# EAGLE design Seeeduino LoRaWan (EAGLE 9.3.2)
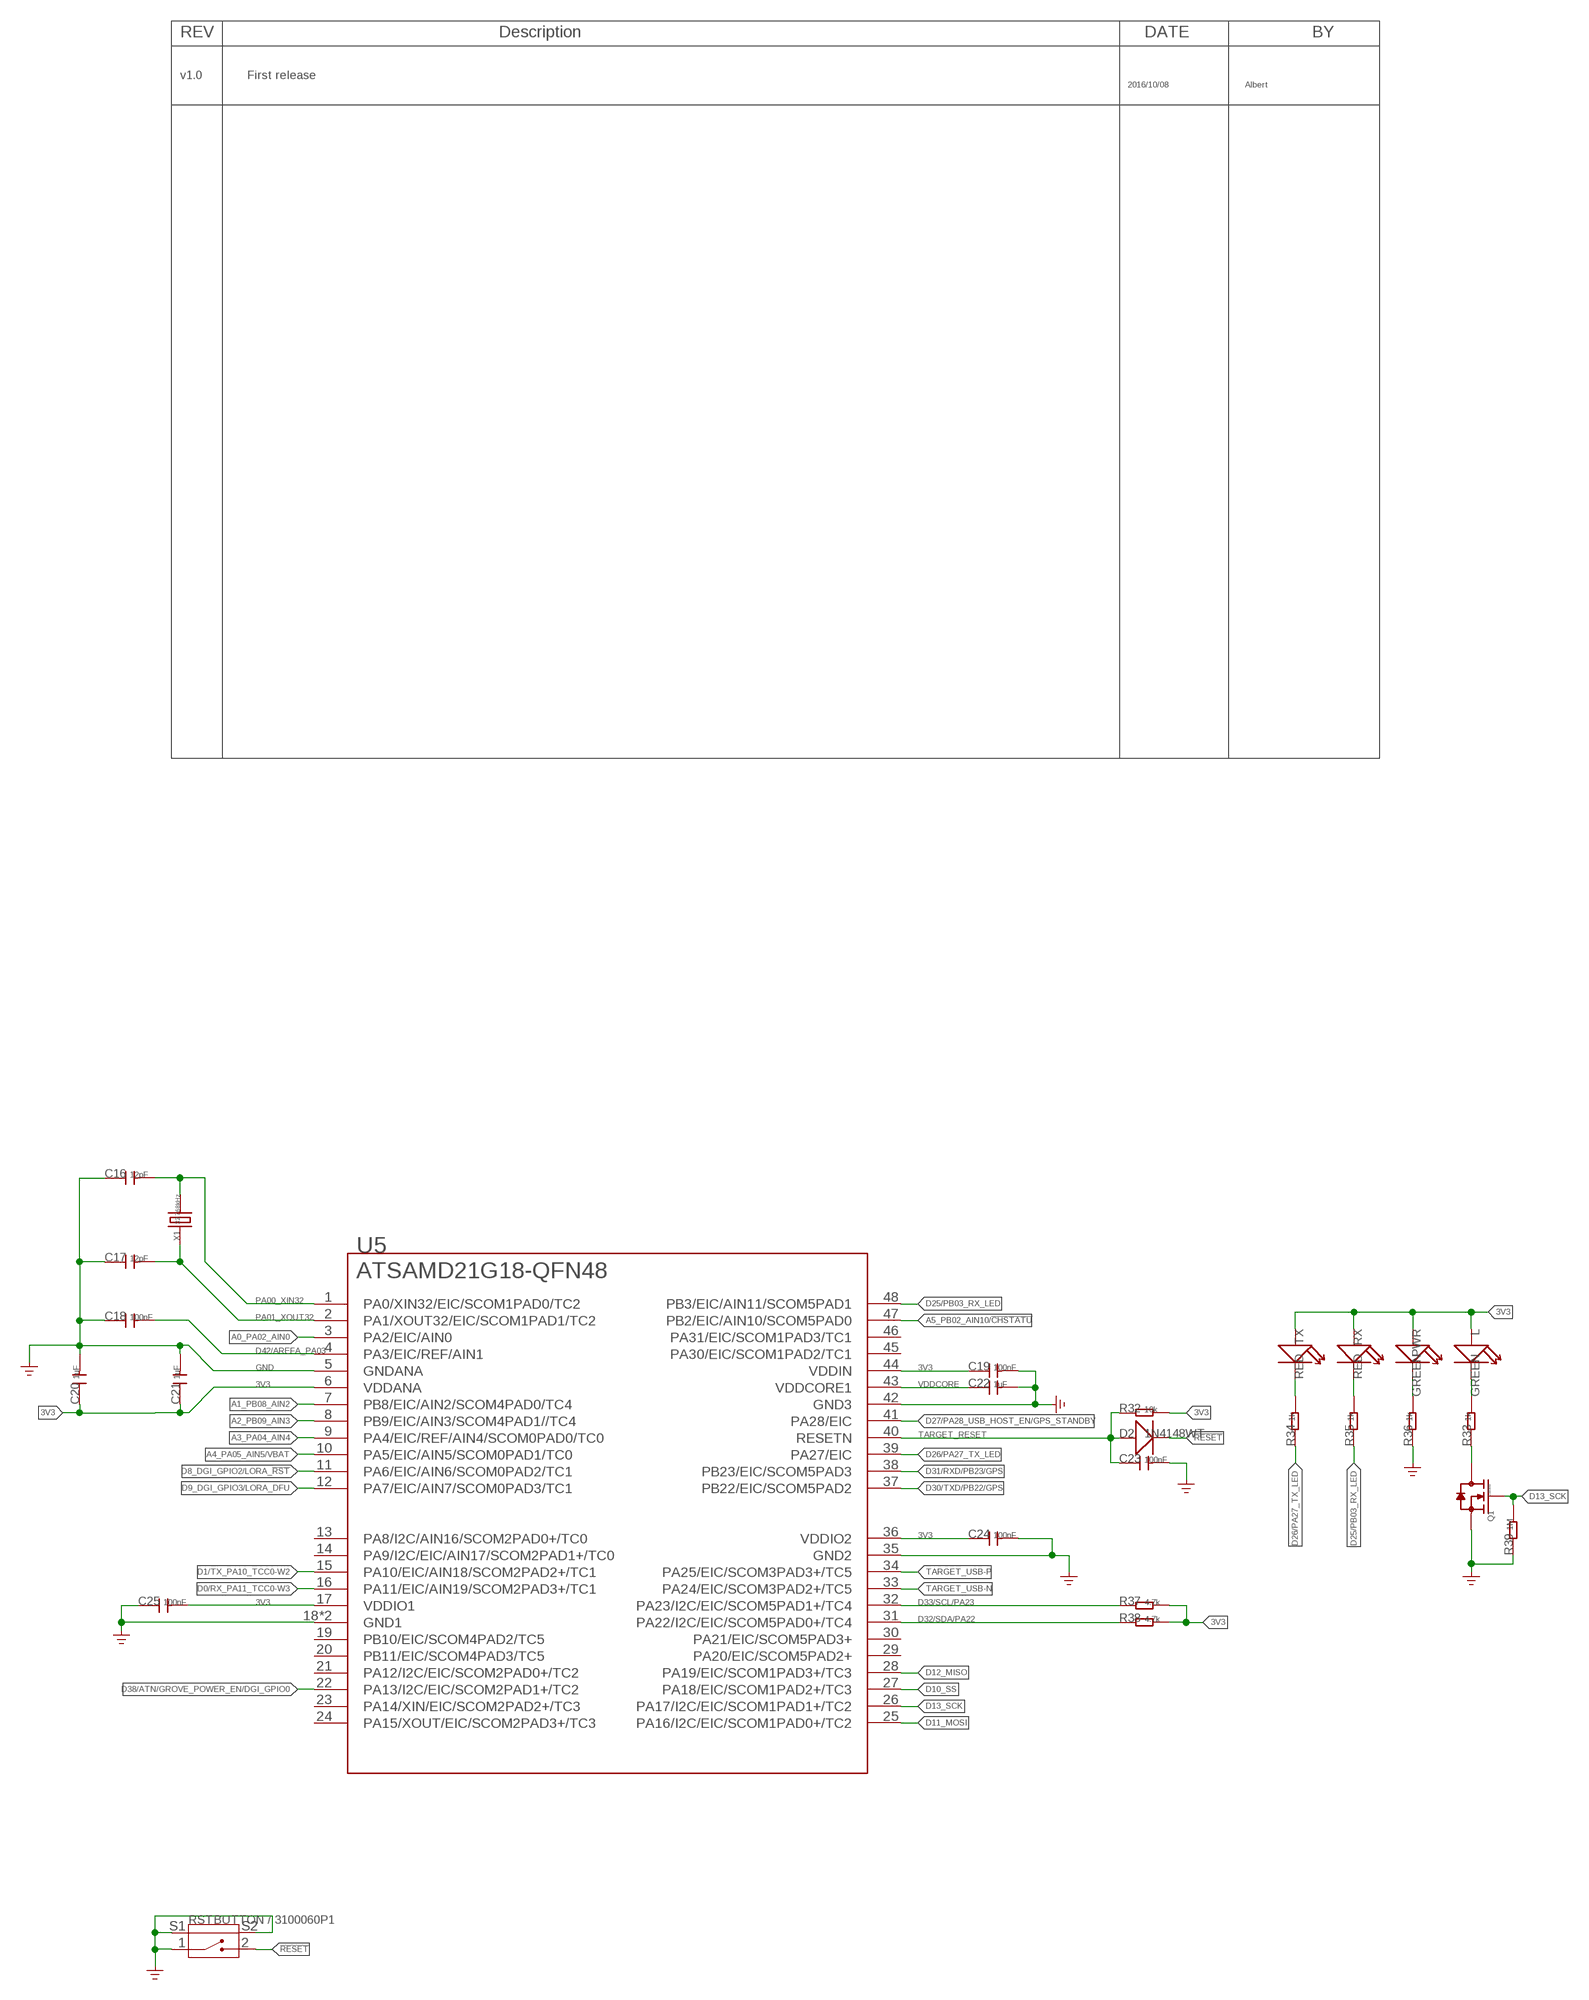
[diagram p0: schematic, sheet 1, part 1 of 2]
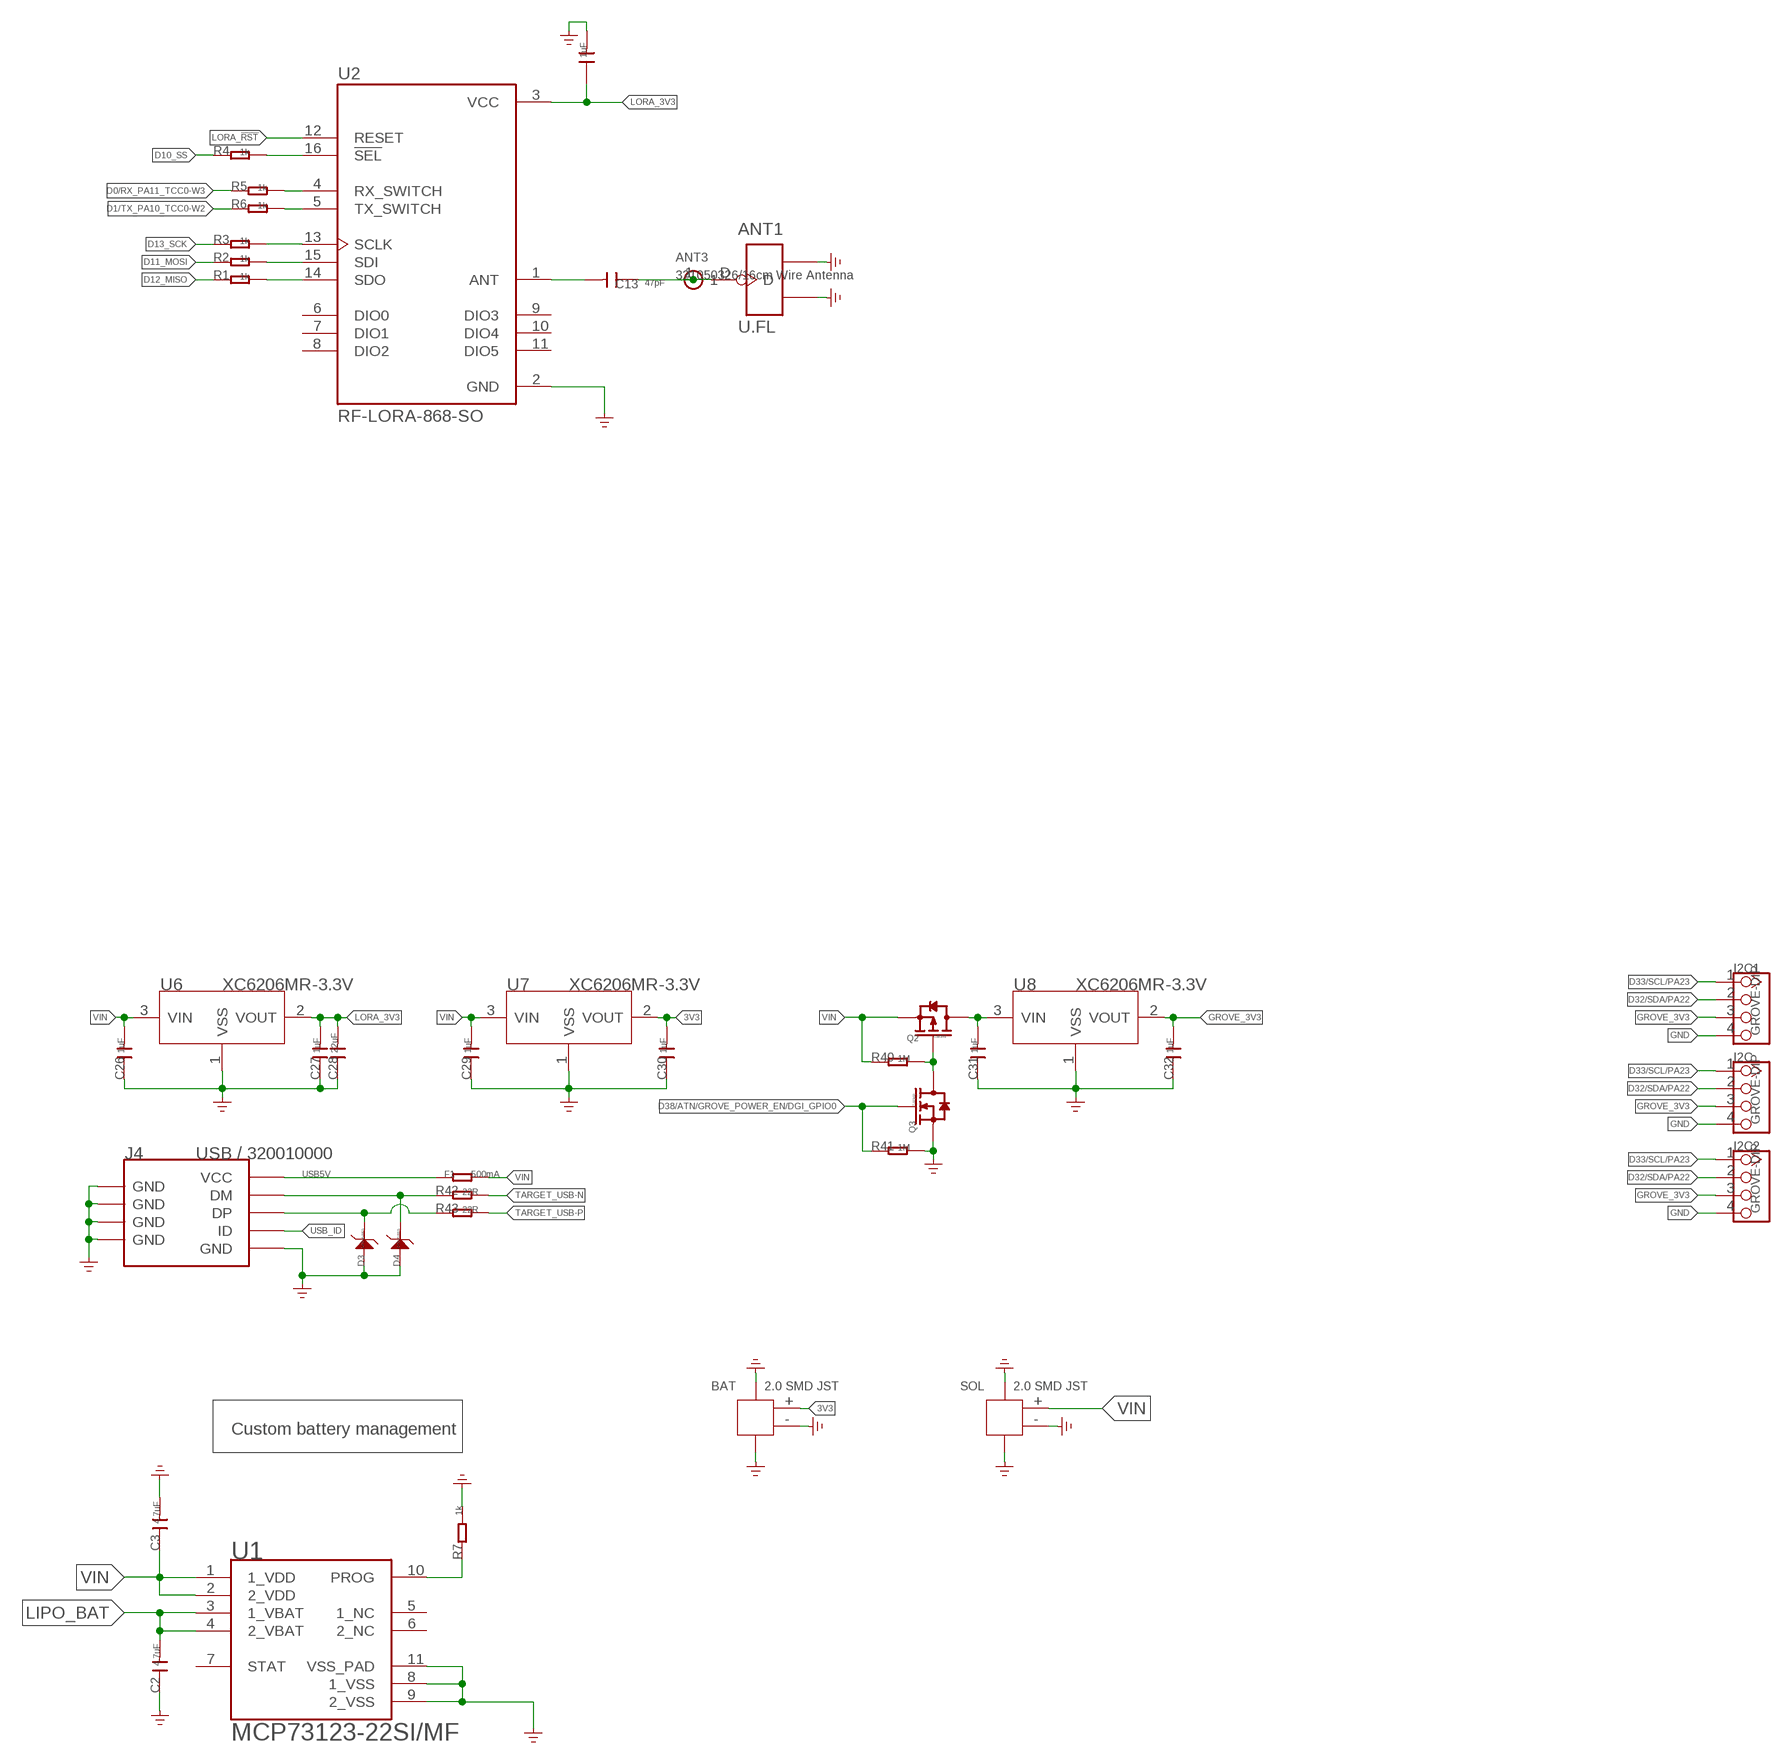
[diagram p1: schematic, sheet 1, part 2 of 2]

## Parts
ANT1  U.FL  ANTENNA-U-FL  [U-FL3P-SMD-2.6X2.6X1.0MM]
ANT3  321050326/16cm Wire Antenna  HEADER-1P-35  [1P-65/35MIL]
BAT  2.0 SMD JST  JST-2P-SMD'2.0'  [HW2-SMD-2.0-90D]
C1  1uF  C-0603  [C0603]
C2  4.7uF  C-0603  [C0603]
C3  4.7uF  C-0603  [C0603]
C13  47pF  C-0603  [C0603]
C16  12pF  C-0603  [C0603]
C17  12pF  C-0603  [C0603]
C18  100nF  C-0603  [C0603]
C19  100nF  C-0603  [C0603]
C20  1uF  C-0603  [C0603]
C21  1uF  C-0603  [C0603]
C22  1uF  C-0603  [C0603]
C23  100nF  C-0603  [C0603]
C24  100nF  C-0603  [C0603]
C25  100nF  C-0603  [C0603]
C26  1uF  C-0603  [C0603]
C27  1uF  C-0603  [C0603]
C28  22uF  C-0603  [C0603]
C29  1uF  C-0603  [C0603]
C30  1uF  C-0603  [C0603]
C31  1uF  C-0603  [C0603]
C32  1uF  C-0603  [C0603]
D2  1N4148WT  D'0603'  [SOD523]
D3  DF2S6.8FS  D-ESD-2P'DF2S6.8FS'  [SOD-923]
D4  DF2S6.8FS  D-ESD-2P'DF2S6.8FS'  [SOD-923]
F1  500mA  R-0603  [R0603]
I2C  GROVE-DIP  TWIG-4P-2.0-2.0  [4P-2.0]
I2C1  GROVE-DIP  TWIG-4P-2.0-2.0  [4P-2.0]
I2C2  GROVE-DIP  TWIG-4P-2.0-2.0  [4P-2.0]
J4  USB / 320010000  USB-MINIUSB-5P-MICRO  [MICRO-USB]
L  GREEN  LED'0603'  [LED-0603]
PWR  GREEN  LED'0603'  [LED-0603]
Q1  CJ2102  MOSFET-N'SI1304BDL'  [SOT-323]
Q2  CJ2101  MOSFET-P-SOT323  [SOT323]
Q3  CJ2102  MOSFET-N'SI1304BDL'  [SOT-323]
R1  1k  R-0603  [R0603]
R2  1k  R-0603  [R0603]
R3  1k  R-0603  [R0603]
R4  1k  R-0603  [R0603]
R5  1k  R-0603  [R0603]
R6  1k  R-0603  [R0603]
R7  1k  R-0603  [R0603]
R32  10k  R-0603  [R0603]
R33  1k  R-0603  [R0603]
R34  1k  R-0603  [R0603]
R35  1k  R-0603  [R0603]
R36  1k  R-0603  [R0603]
R37  4.7k  R-0603  [R0603]
R38  4.7k  R-0603  [R0603]
R39  1M  R-0603  [R0603]
R40  1M  R-0603  [R0603]
R41  1M  R-0603  [R0603]
R42  22R  R-0603  [R0603]
R43  22R  R-0603  [R0603]
RST  BUTTON / 3100060P1  BUTTON-2P-REINFORCE-3100060P1  [4P-SMD-7.0X3.5X3.5H-90D]
RX  RED  LED'0603'  [LED-0603]
SOL  2.0 SMD JST  JST-2P-SMD'2.0'  [HW2-SMD-2.0-90D]
TX  RED  LED'0603'  [LED-0603]
U1  MICROCHIP_MCP73123-22SI-MFMICROCHIP_MCP73123-22SI-MF_0_0  [MICROCHIP_MCP73123-22SI-MF_0]
U2  RF-LORA-868-SO  [XCVR_RF-LORA-868-SO]
U5  ATSAMD21G18-QFN48  [QFN48-7X7]
U6  XC6206MR-3.3V  XC6206MR  [SOT23]
U7  XC6206MR-3.3V  XC6206MR  [SOT23]
U8  XC6206MR-3.3V  XC6206MR  [SOT23]
X1  32.768kHz  CRYSTAL-2P-3215  [X2-SMD-3.2X1.5X0.55MM]

## Nets
3V3: BAT.+ C19.1 C20.1 C21.1 C24.1 C25.2 C30.2 L.+ PWR.+ R32.2 R37.2 R38.2 RX.+ TX.+ U5.6(VDDANA) U5.17(VDDIO1) U5.36(VDDIO2) U5.44(VDDIN) U7.2(VOUT)
!RESET: D2.- RST.2
A0_PA02_AIN0: U5.3(PA2/EIC/AIN0)
A1_PB08_AIN2: U5.7(PB8/EIC/AIN2/SCOM4PAD0/TC4)
A2_PB09_AIN3: U5.8(PB9/EIC/AIN3/SCOM4PAD1//TC4)
A3_PA04_AIN4: U5.9(PA4/EIC/REF/AIN4/SCOM0PAD0/TC0)
A4_PA05_AIN5/VBAT: U5.10(PA5/EIC/AIN5/SCOM0PAD1/TC0)
A5_PB02_AIN10/!CHSTATU: U5.47(PB2/EIC/AIN10/SCOM5PAD0)
D0/RX_PA11_TCC0-W3: R5.1 U5.16(PA11/EIC/AIN19/SCOM2PAD3+/TC1)
D1/TX_PA10_TCC0-W2: R6.1 U5.15(PA10/EIC/AIN18/SCOM2PAD2+/TC1)
D8_DGI_GPIO2/LORA_!RST: U5.11(PA6/EIC/AIN6/SCOM0PAD2/TC1)
D9_DGI_GPIO3/LORA_DFU: U5.12(PA7/EIC/AIN7/SCOM0PAD3/TC1)
D10_SS: R4.1 U5.27(PA18/EIC/SCOM1PAD2+/TC3)
D11_MOSI: R2.1 U5.25(PA16/I2C/EIC/SCOM1PAD0+/TC2)
D12_MISO: R1.1 U5.28(PA19/EIC/SCOM1PAD3+/TC3)
D13_SCK: Q1.1(G) R3.1 R39.2 U5.26(PA17/I2C/EIC/SCOM1PAD1+/TC2)
D25/PB03_RX_LED: R35.1 U5.48(PB3/EIC/AIN11/SCOM5PAD1)
D26/PA27_TX_LED: R34.1 U5.39(PA27/EIC)
D27/PA28_USB_HOST_EN/GPS_STANDBY: U5.41(PA28/EIC)
D30/TXD/PB22/GPS: U5.37(PB22/EIC/SCOM5PAD2)
D31/RXD/PB23/GPS: U5.38(PB23/EIC/SCOM5PAD3)
D32/SDA/PA22: I2C1.2 I2C2.2 I2C.2 R38.1 U5.31(PA22/I2C/EIC/SCOM5PAD0+/TC4)
D33/SCL/PA23: I2C1.1 I2C2.1 I2C.1 R37.1 U5.32(PA23/I2C/EIC/SCOM5PAD1+/TC4)
D38/ATN/GROVE_POWER_EN/DGI_GPIO0: Q3.1(G) R41.1 U5.22(PA13/I2C/EIC/SCOM2PAD1+/TC2)
D42/AREFA_PA03: C18.2 U5.4(PA3/EIC/REF/AIN1)
GND: ANT1.GND1 ANT1.GND2 BAT.3 BAT.4 BAT.- C1.2 C2.1 C3.2 C16.1 C17.1 C18.1 C19.2 C20.2 C21.2 C22.2 C23.2 C24.2 C25.1 C26.1 C27.1 C28.1 C29.1 C30.1 C31.1 C32.1 D3.2 D4.2 I2C1.4 I2C2.4 I2C.4 J4.5(GND) J4.S1(GND) J4.S2(GND) J4.S3(GND) J4.S4(GND) J4.S5(GND) J4.S6(GND) Q1.2(S) Q3.2(S) R7.2 R36.1 R39.1 R41.2 RST.1 RST.S1 RST.S2 SOL.3 SOL.4 SOL.- U1.8(1_VSS) U1.9(2_VSS) U1.11(VSS_PAD) U2.2(GND) U5.5(GNDANA) U5.18(GND1) U5.35(GND2) U5.42(GND3) U5.PAD(GND1) U6.1(VSS) U7.1(VSS) U8.1(VSS) ; supply symbol labelled GND_POWER
GROVE_3V3: C32.2 I2C1.3 I2C2.3 I2C.3 U8.2(VOUT)
LIPO_BAT: C2.2 U1.3(1_VBAT) U1.4(2_VBAT)
LORA_3V3: C1.1 C27.2 C28.2 U2.3(VCC) U6.2(VOUT)
N$1: Q1.3(D) R33.1
N$2: R34.2 TX.-
N$3: C13.2 U2.1(ANT)
N$4: R35.2 RX.-
N$5: L.- R33.2
N$6: R1.2 U2.14(SDO)
N$7: D3.1 J4.3(DP) R43.1
N$10: D4.1 J4.2(DM) R42.1
N$11: ANT1.D ANT3.1 C13.1
N$12: PWR.- R36.2
N$13: R2.2 U2.15(SDI)
N$14: R3.2 U2.13(SCLK)
N$15: R4.2 U2.16(!SEL)
N$16: R5.2 U2.4(RX_SWITCH)
N$17: R6.2 U2.5(TX_SWITCH)
N$18: R7.1 U1.10(PROG)
N$20: U2.12(RESET)
N$45: C31.2 Q2.3(D) U8.3(VIN)
N$53: Q2.1(G) Q3.3(D) R40.2
PA00_XIN32: C16.2 U5.1(PA0/XIN32/EIC/SCOM1PAD0/TC2) X1.2
PA01_XOUT32: C17.2 U5.2(PA1/XOUT32/EIC/SCOM1PAD1/TC2) X1.1
TARGET_RESET: C23.1 D2.+ R32.1 U5.40(RESETN)
TARGET_USB-N: R42.2 U5.33(PA24/EIC/SCOM3PAD2+/TC5)
TARGET_USB-P: R43.2 U5.34(PA25/EIC/SCOM3PAD3+/TC5)
USB5V: F1.1 J4.1(VCC)
USB_ID: J4.4(ID)
VDDCORE: C22.1 U5.43(VDDCORE1)
VIN: C3.1 C26.2 C29.2 F1.2 Q2.2(S) R40.1 SOL.+ U1.1(1_VDD) U1.2(2_VDD) U6.3(VIN) U7.3(VIN)
Unconnected: U1.5(1_NC) U1.6(2_NC) U1.7(STAT) U2.6(DIO0) U2.7(DIO1) U2.8(DIO2) U2.9(DIO3) U2.10(DIO4) U2.11(DIO5) U5.13(PA8/I2C/AIN16/SCOM2PAD0+/TC0) U5.14(PA9/I2C/EIC/AIN17/SCOM2PAD1+/TC0) U5.19(PB10/EIC/SCOM4PAD2/TC5) U5.20(PB11/EIC/SCOM4PAD3/TC5) U5.21(PA12/I2C/EIC/SCOM2PAD0+/TC2) U5.23(PA14/XIN/EIC/SCOM2PAD2+/TC3) U5.24(PA15/XOUT/EIC/SCOM2PAD3+/TC3) U5.29(PA20/EIC/SCOM5PAD2+) U5.30(PA21/EIC/SCOM5PAD3+) U5.45(PA30/EIC/SCOM1PAD2/TC1) U5.46(PA31/EIC/SCOM1PAD3/TC1)

## Notes on the sheet
- v1.0 | First release
- 2016/10/08 | Albert
- Custom battery management

## Library data of the parts
ANT1 = Connector-update:ANTENNA-U-FL: 320110048
ANT3 = Connector:HEADER-1P
BAT SOL = Connector-update:JST-2P-SMD: 2P-SMD-1.0-90D:320110054;2P-SMD-2.0-90D:320110026
C1-C3 C13 C16-C32 = Discrete:C*: Ceramic Capacitors
D2 = Discrete:D*
D3 D4 = Discrete-new:D-ESD-2P: SOD-923:304060009;SOD-123:304060001
F1 = Discrete-smallsmall:R*
I2C I2C1 I2C2 = Connector:TWIG-4P-2.0
J4 = Connector:USB-MINIUSB-5P
L PWR RX TX = Discrete:LED*
Q1 Q3 = Discrete-new:MOSFET-N
Q2 = Discrete:MOSFET-P
R1-R7 R32-R43 = Discrete:R*
RST = Discrete:BUTTON-2P-REINFORCE: TS-1188E http://www.best-dz.com/?thread-374-2.html SMD Button
U1 = PMIC:MICROCHIP_MCP73123-22SI-MF: Lithium Iron Phosphate (LiFePO4) Battery Charge Management Controller with Input Overvoltage Protection; CENTROID_NOT_SPECIFIED: No; DATASHEET: https://upverter.com/datasheet/166ccaed19ce623439533fa8540cd622d7261b1c.pdf; DIGIKEY_DESCRIPTION: IC LI IRON PHOSPHATE CTRLR 10DFN; DIGIKEY_PART_NUMBER: MCP73123-22SI/MF-ND; LEAD_FREE: yes; MF: Microchip; MOUSER_PART_NUMBER: 579-MCP73123-22SI/MF; MPN: MCP73123-22SI/MF; PACKAGE: 10-DFN; PREFIX: U; ROHS: yes; TEMPERATURE_RANGE_HIGH: +85°C; TEMPERATURE_RANGE_LOW: -40°C
U2 = LoRa:RF-LORA-868-SO: LORA RF Tranceiver Module 16km 1272 SO; DESCRIPTION: LORA RF Tranceiver Module 16km 1272 SO; DIGI-KEY_PART_NUMBER: RF-LORA-868-SO-ND; DIGI-KEY_PURCHASE_URL: https://www.digikey.com/product-detail/en/rf-solutions/RF-LORA-868-SO/RF-LORA-868-SO-ND/5291460?utm_source=snapeda&utm_medium=aggregator&utm_campaign=symbol; MF: RF Solutions; MP: RF-LORA-868-SO; PACKAGE: Module RF Solutions
U5 = AMLib_New:ATSAMD21G18: Atmel D21 32bit ARM Cortex-M0 microcontroller - 48 PIN TQFP 256KB flash memory + 32KB SRAM
U6-U8 = IC:XC6206: LOW ESR Cap.Compatible Positive Voltage Regulators
X1 = Discrete-new:CRYSTAL-2P

## Net classes
0 default: width 0.025 mm, drill 0.203 mm, clearance 0.127 mm

## Board
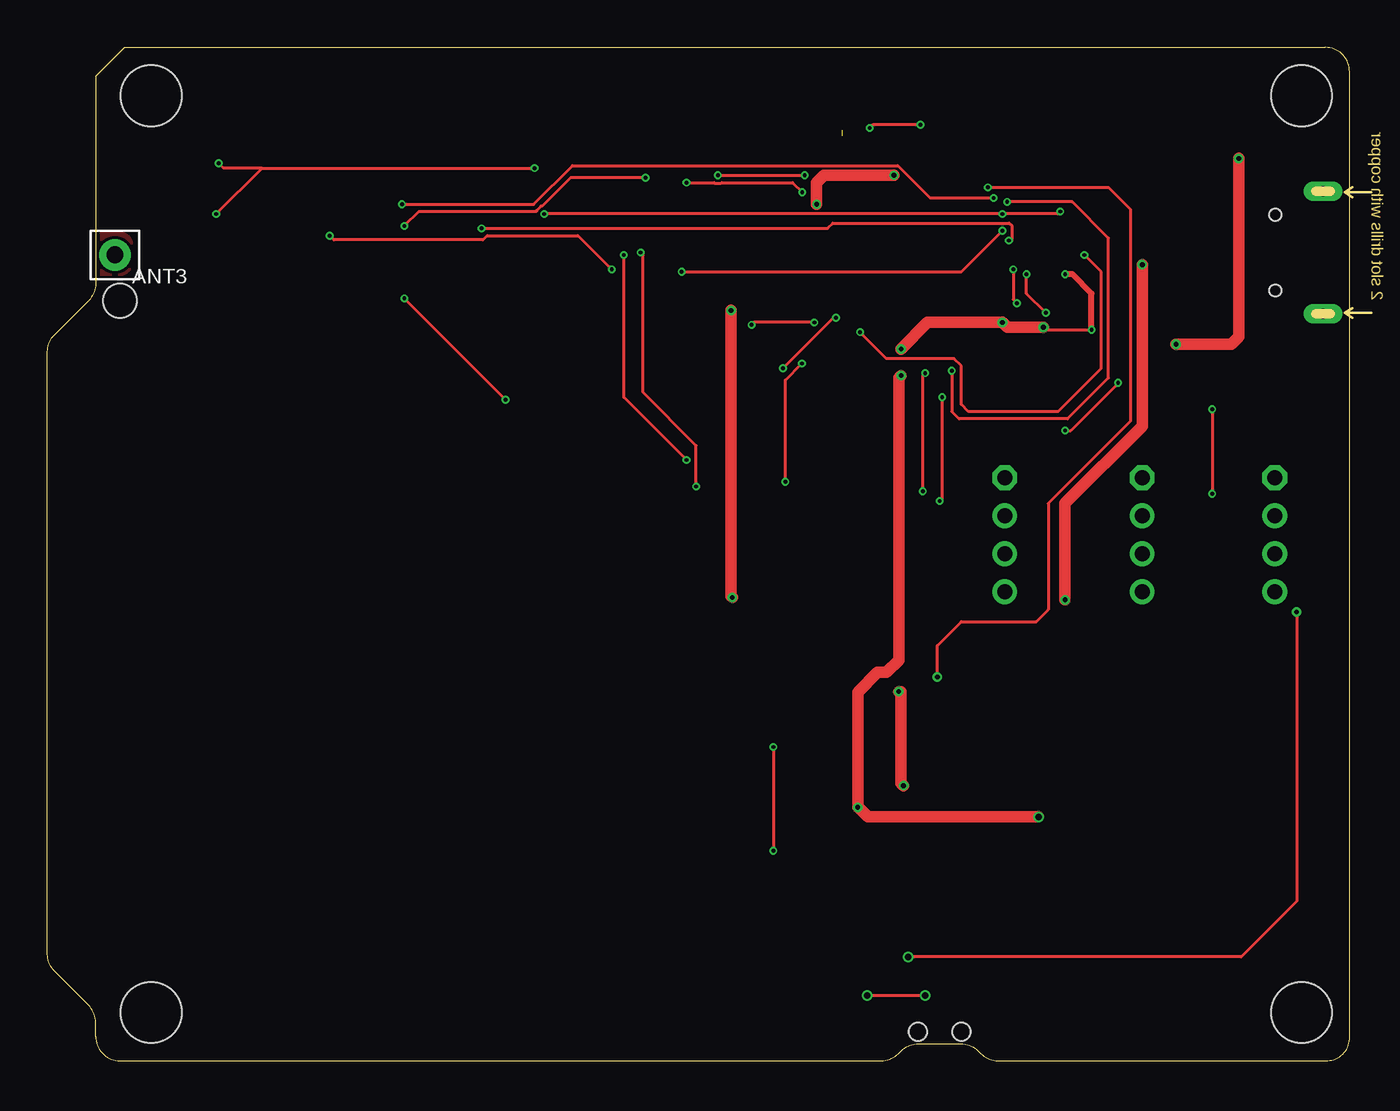
[diagram p2: board, top side]
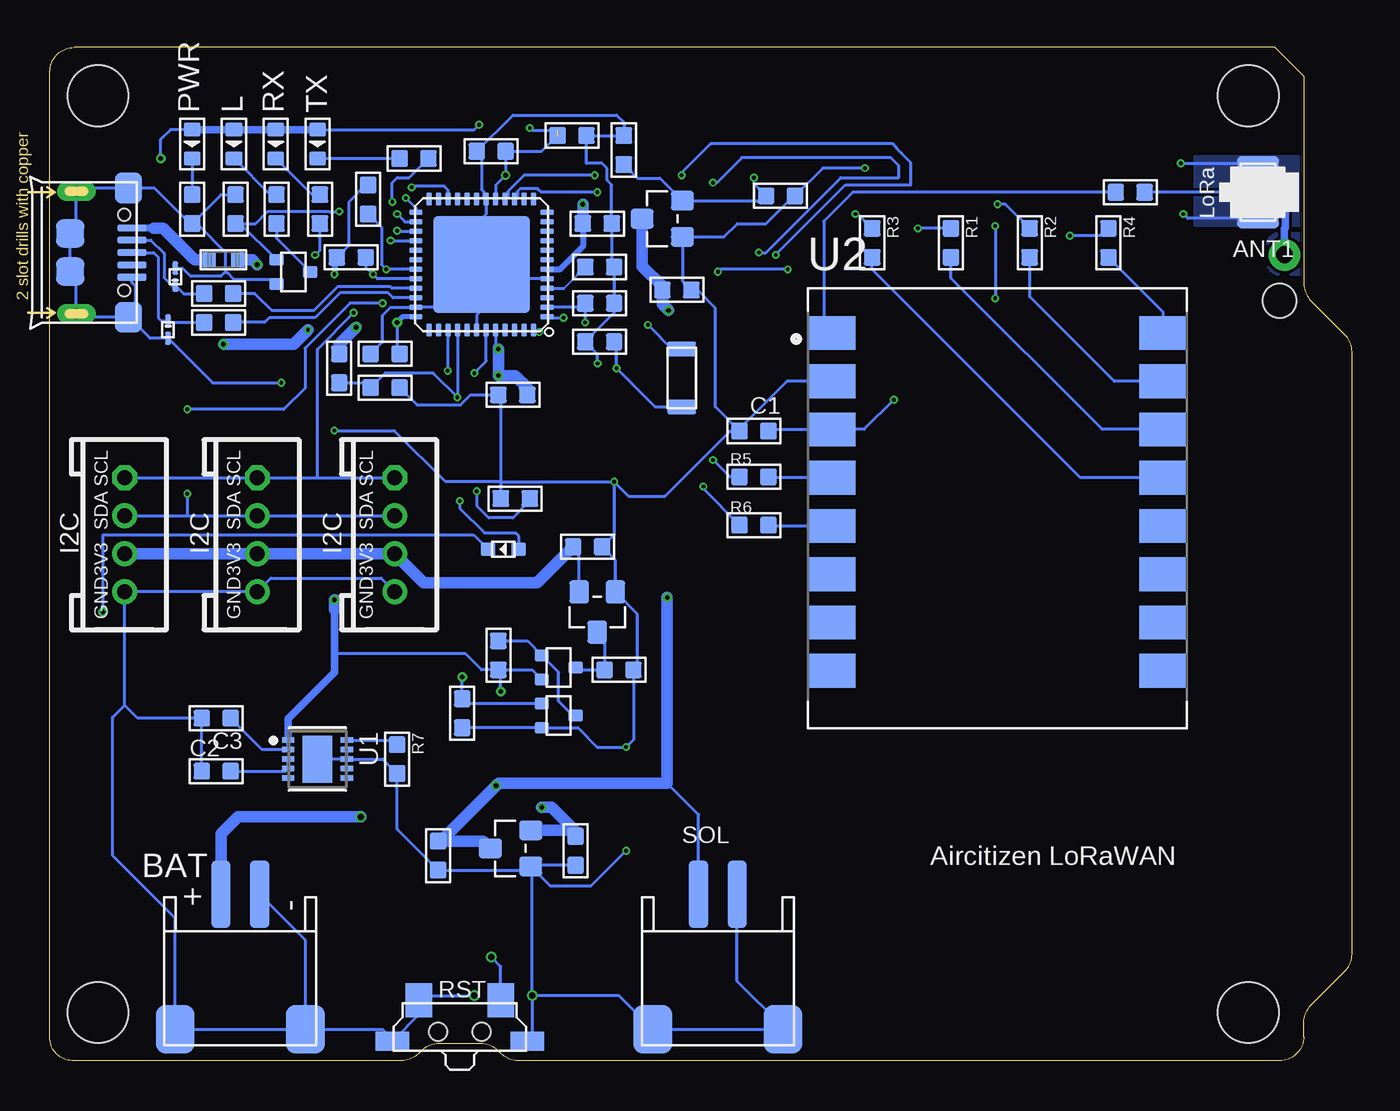
[diagram p3: board, bottom side, seen from below]

Size 68.58 x 53.34 mm. Coordinates in mm from the lower left corner, seen from the top.
Outline: 68.58,52.07 arc90 67.31,53.34 4.06,53.34 2.54,51.82 2.54,40.91 arc-45 2.17,40.01 0.37,38.22 arc45 0,37.32 0,5.61 arc45 0.37,4.71 2.17,2.91 arc-45 2.54,2.01 2.54,1.27 arc90 3.81,0 43.92,0 arc45 44.82,0.37 44.97,0.52 arc-45 45.87,0.89 48.12,0.89 arc-45 49.01,0.52 49.16,0.37 arc45 50.06,0 67.31,0 arc90 68.58,1.14 68.58,52.07
Copper layers (1*16): Top 0.035mm / dielectric 1.5mm / Bottom 0.035mm
Design rules "default *": minimum track width 1mil, minimum drill 8mil, track to track 5mil, track to pad 5mil, pad to pad 5mil, via to via 5mil, smd to smd 0mil, copper to edge 8mil, drill to drill 8mil, minimum pad ring 4mil, minimum via ring 4mil, stop-mask expansion 4mil, vias tented up to drill 20mil, thermal gap 10mil
Holes 3.2 mm at 66.04,2.54 66.04,50.8 5.46,2.54 5.46,50.8
Holes 1.78 mm at 3.81,40.01
bRestrict: area 42.9,39 to 48.8,44.8; area 51.1,19.3 to 53.1,21.3

### Footprints (pad centres in the part's own frame; a part is rotated, then mirrored left to right if it is on the bottom)
U-FL3P-SMD-2.6X2.6X1.0MM = smd 1.05 x 1: D -1.397,0 | smd 2.2 x 1.05: GND1 0,1.373; GND2 0,-1.373
1P-65/35MIL = drill 0.889 pad 1.651: 1 0,0
HW2-SMD-2.0-90D = smd 2.032 x 2.54: 3 3.429,-2.159; 4 -3.429,-2.159 | smd 1.016 x 3.556: + -1.016,4.953; - 1.016,4.953
C0603 = smd 0.889 x 0.889: 1 -0.762,0; 2 0.762,0
SOD523 = smd 0.762 x 0.7: + -0.8,0; - 0.8,0
SOD-923 = smd 0.7 x 0.3: 1 -0.45,0; 2 0.45,0
R0603 = smd 0.7 x 0.8: 1 -0.75,0; 2 0.75,0
4P-2.0 = drill 0.8 pad 1.3 octagon: 1 -3,0 | drill 0.8 pad 1.3: 2 -1,0; 3 1,0; 4 3,0
MICRO-USB = smd 0.381 x 1.524: 1 -1.3,-0.25; 2 -0.65,-0.25; 3 0,-0.25; 4 0.65,-0.25; 5 1.3,-0.25 | smd 1.6 x 1.397: S1 -3.4,-0.427; S6 3.4,-0.427 | drill 0.508 pad 1.016 long: S2 -3.226,-3.175; S5 3.226,-3.175 | smd 1.5 x 1.5: S3 -1,-3.5; S4 1,-3.5 | hole 0.635: -2,-0.65; 2,-0.65
LED-0603 = smd 0.762 x 0.889: + -0.762,0; - 0.762,0
SOT-323 = smd 0.635 x 0.762: 1 -0.635,-0.889; 2 0.635,-0.889; 3 0,0.889
SOT323 = smd 0.635 x 0.762: 1 -0.635,-0.889; 2 0.635,-0.889; 3 0,0.889
R0603' = smd 0.889 x 0.889: 1 -0.762,0; 2 0.762,0
4P-SMD-7.0X3.5X3.5H-90D = smd 1.397 x 1.778: 1 -2.159,1.651; 2 2.159,1.651 | smd 1.778 x 1.016: S1 -3.556,-0.508; S2 3.556,-0.508 | hole 0.95: -1.15,0; 1.15,0
MICROCHIP_MCP73123-22SI-MF_0 = smd 0.3 x 0.65: 1 -1,-1.55; 2 -0.5,-1.55; 3 0,-1.55; 4 0.5,-1.55; 5 1,-1.55; 6 1,1.55; 7 0.5,1.55; 8 0,1.55; 9 -0.5,1.55; 10 -1,1.55 | smd 2.48 x 1.55: 11 0,0
XCVR_RF-LORA-868-SO = smd 2.5 x 1.78: 1 -8.725,9.225; 2 -8.725,6.685; 3 -8.725,4.145; 4 -8.725,1.605; 5 -8.725,-0.935; 6 -8.725,-3.475; 7 -8.725,-6.015; 8 -8.725,-8.555; 9 8.725,-8.555; 10 8.725,-6.015; 11 8.725,-3.475; 12 8.725,-0.935; 13 8.725,1.605; 14 8.725,4.145; 15 8.725,6.685; 16 8.725,9.225
QFN48-7X7 = smd 0.7 x 0.3: 1 -3.45,2.75; 2 -3.45,2.25; 3 -3.45,1.75; 4 -3.45,1.25; 5 -3.45,0.75; 6 -3.45,0.25; 7 -3.45,-0.25; 8 -3.45,-0.75; 9 -3.45,-1.25; 10 -3.45,-1.75; 11 -3.45,-2.25; 12 -3.45,-2.75; 25 3.45,-2.75; 26 3.45,-2.25; 27 3.45,-1.75; 28 3.45,-1.25; 29 3.45,-0.75; 30 3.45,-0.25; 31 3.45,0.25; 32 3.45,0.75; 33 3.45,1.25; 34 3.45,1.75; 35 3.45,2.25; 36 3.45,2.75 | smd 0.3 x 0.7: 13 -2.75,-3.45; 14 -2.25,-3.45; 15 -1.75,-3.45; 16 -1.25,-3.45; 17 -0.75,-3.45; 18 -0.25,-3.45; 19 0.25,-3.45; 20 0.75,-3.45; 21 1.25,-3.45; 22 1.75,-3.45; 23 2.25,-3.45; 24 2.75,-3.45; 37 2.75,3.45; 38 2.25,3.45; 39 1.75,3.45; 40 1.25,3.45; 41 0.75,3.45; 42 0.25,3.45; 43 -0.25,3.45; 44 -0.75,3.45; 45 -1.25,3.45; 46 -1.75,3.45; 47 -2.25,3.45; 48 -2.75,3.45 | smd 5.1 x 5.1: PAD 0,0
SOT23 = smd 1.016 x 1.2: 1 -0.95,-1.06; 2 0.95,-1.06; 3 0,1.06
X2-SMD-3.2X1.5X0.55MM = smd 0.762 x 1.524: 1 -1.524,0; 2 1.524,0

### Placement (x,y rotation side)
ANT1  4.95,45.72 180 bottom
ANT3  3.56,42.42 0 top
BAT  58.55,3.81 0 bottom
C1  31.5,33.15 180 bottom
C2  59.82,15.24 0 bottom
C3  59.82,18.03 180 bottom
C13  11.68,45.72 180 bottom
C16  39.62,37.85 0 bottom
C17  39.62,39.88 180 bottom
C18  39.62,41.78 180 bottom
C19  44.2,35.05 180 bottom
C20  41.08,48.71 0 bottom
C21  39.75,44.07 0 bottom
C22  44.07,29.59 180 bottom
C23  50.93,35.43 0 bottom
C24  50.93,37.21 180 bottom
C25  45.34,47.88 0 bottom
C26  35.56,40.58 180 bottom
C27  38.35,47.94 270 bottom
C28  30.1,45.53 180 bottom
C29  48.13,10.8 90 bottom
C30  40.89,11.05 90 bottom
C31  38.61,20.57 180 bottom
C32  40.26,27.05 180 bottom
D2  44.7,26.92 180 bottom
D3  62.36,38.48 270 bottom
D4  61.98,41.28 90 bottom
F1  59.44,42.16 0 bottom
I2C  64.64,27.69 270 bottom
I2C1  57.66,27.69 270 bottom
I2C2  50.42,27.69 270 bottom
J4  64.01,42.55 270 bottom
L  58.89,48.26 270 bottom
PWR  61.09,48.26 270 bottom
Q1  55.75,41.53 270 bottom
Q2  41.78,20.7 270 bottom
Q3  41.78,18.16 270 bottom
R1  1k  [R0603']  21.12,43.05 270 bottom
R2  1k  [R0603']  16.98,43.05 270 bottom
R3  1k  [R0603']  25.27,43.05 270 bottom
R4  1k  [R0603']  12.83,43.05 270 bottom
R5  1k  [R0603']  31.5,30.73 0 bottom
R6  1k  [R0603']  31.5,28.19 0 bottom
R7  1k  [R0603']  50.29,15.88 270 bottom
R32  10k  [R0603']  53.34,36.45 90 bottom
R33  1k  [R0603']  56.64,44.83 90 bottom
R34  1k  [R0603']  49.4,47.5 180 bottom
R35  1k  [R0603']  54.36,44.83 90 bottom
R36  1k  [R0603']  61.09,44.83 90 bottom
R37  4.7k  [R0603']  52.7,42.29 180 bottom
R38  4.7k  [R0603']  51.82,45.34 90 bottom
R39  1M  [R0603']  58.8,44.83 270 bottom
R40  1M  [R0603']  44.96,21.34 90 bottom
R41  1M  [R0603']  46.86,18.29 270 bottom
R42  22R  [R0603']  59.69,40.39 0 bottom
R43  22R  [R0603']  59.69,38.86 0 bottom
RST  46.99,1.52 0 bottom
RX  56.68,48.26 270 bottom
SOL  33.4,3.81 0 bottom
TX  54.48,48.26 270 bottom
U1  54.48,15.88 270 bottom
U2  18.67,29.08 0 bottom
U5  45.85,41.91 180 bottom
U6  36.32,44.32 90 bottom
U7  44.32,11.18 90 bottom
U8  39.75,23.62 180 bottom
X1  35.31,35.94 270 bottom

### Tracks (layer width: path | path; a pad name or v marks a point on that pad's centre or on a via)
3V3  (via drill 0.2, 0.2 pad 0.41, 0.25 pad 0.41, 0.25 pad 0.51, 0.35)  (1 unrouted)
  Top 0.152: v52.45,38.61 52.58,38.48 v54.99,38.48 | v45.97,49.28 43.48,49.28 v43.31,49.1
  Top 0.305: v54.99,38.48 54.99,40.39 53.98,41.4 v53.59,41.4
  Top 0.61: v44.96,37.47 46.35,38.86 v50.29,38.86 50.55,38.61 v52.45,38.61 | v44.58,46.61 40.89,46.61 40.51,46.23 v40.51,45.09 | v44.96,36.07 44.83,35.94 44.83,22.1 | 44.83,21.21 44.83,22.1 | 44.83,22.1 44.83,21.08 44.2,20.45 43.72,20.45 42.67,19.4 v42.67,13.34 42.67,13.36 43.2,12.83 v52.2,12.83 | v62.74,47.5 62.74,38.1 62.36,37.72 v59.44,37.72
  Bottom 0.152: U5.17 45.1,46.09 v44.58,46.61 C25.2 42.67,47.88 C20.1 | PWR.+ 62.23,49.02 62.74,48.51 v62.74,47.5 | R37.2 52.83,42.93 52.83,45.21 51.94,46.1 R38.2 | U5.44 45.1,37.6 | v50.29,38.86 50.29,37.34 C24.1 | TX.+ 46.23,49.02 v45.97,49.28 | v43.31,49.1 43.18,48.97 41.85,48.97
  Bottom 0.254: U5.36 49.99,39.16 v50.29,38.86
  Bottom 0.305: 45.1,37.6 v44.96,37.47 | v53.59,41.4 53.59,42.16 R37.2 | U5.6 41.72,41.66 40.51,42.86 C21.1
  Bottom 0.406: TX.+ RX.+ L.+ PWR.+
  Bottom 0.61: v59.44,37.72 55.75,37.72 v54.99,38.48 | v52.45,38.61 53.34,37.72 R32.2 | v44.96,37.47 v44.96,36.07 44.07,36.07 43.43,35.43 C19.1 | v40.51,45.09 C21.1 | BAT.+ 59.56,11.94 58.67,12.83 v52.2,12.83 | v42.67,13.34 42.16,13.34 40.89,12.07 C30.2 41.21,12.13 U7.2
!RESET  (via drill 0.25 pad 0.51, 0.35)
  Top 0.152: v65.79,23.62 65.79,8.38 62.87,5.46 v45.34,5.46
  Bottom 0.152: v65.79,23.62 65.79,27.69 46.27,27.69 D2.- | v45.34,5.46 44.83,4.95 RST.2
A5_PB02_AIN10/!CHSTATU
  Bottom 0.152: U5.47 43.6,38.33
D0/RX_PA11_TCC0-W3  (via drill 0.2)
  Top 0.152: v33.66,31.62 30.35,34.93 v30.35,42.42 | v35.31,46.61 v39.88,46.61
  Bottom 0.152: R5.1 32.77,30.73 v33.66,31.62 | v30.35,42.42 26.67,46.1 23.24,46.1 23.24,47.28 23.5,47.54 arc2 24.19,48.26 33.78,48.26 35.31,46.74 v35.31,46.61 | U5.16 44.45,45.51 44.45,45.77 43.61,46.61 v39.88,46.61
D1/TX_PA10_TCC0-W2  (via drill 0.2)
  Top 0.152: v34.16,30.23 34.16,32.39 31.37,35.18 31.37,42.42 v31.24,42.55 | v39.75,45.72 39.24,46.23 35.5,46.23 35.47,46.2 35.14,46.2 35.11,46.23 v33.66,46.23
  Bottom 0.152: R6.1 34.16,30.1 v34.16,30.23 | v31.24,42.55 30.86,42.55 26.92,46.48 23.88,46.48 23.88,47.12 24.3,47.54 32.13,47.54 33.44,46.23 v33.66,46.23 | U5.15 43.95,45.51 43.95,45.77 43.8,45.91 42.89,45.91 42.7,45.72 v39.75,45.72
D10_SS  (via drill 0.2, 0.2 pad 0.41)
  Top 0.152: v29.72,41.66 27.94,43.43 23.16,43.43 22.93,43.21 15.09,43.21 v14.86,43.43 | v33.4,41.53 48.13,41.53 v50.29,43.69
  Bottom 0.152: R4.1 13.21,43.43 v14.86,43.43 | v29.72,41.66 33.27,41.66 v33.4,41.53 | v50.29,43.69 50.26,43.66 U5.27
D11_MOSI  (via drill 0.2 pad 0.41)
  Top 0.152: v18.67,45.09 25.61,45.09 27.64,47.12 44.79,47.12 46.49,45.42 v49.83,45.42
  Bottom 0.152: R2.1 18.25,45.09 v18.67,45.09 | v49.83,45.42 49.3,44.88 U5.25
D12_MISO  (via drill 0.2 pad 0.41)
  Top 0.152: v22.86,43.82 41.08,43.82 41.36,44.09 50.65,44.09 50.8,43.94 50.8,43.18 v50.64,43.18
  Bottom 0.152: R1.1 v22.86,43.82 | v50.64,43.18 49.31,43.18 U5.28
D13_SCK  (via drill 0.2, 0.2 pad 0.41)
  Top 0.152: v26.16,44.58 v50.29,44.58 53.21,44.58 v53.34,44.7
  Bottom 0.152: Q1.1 58.55,44.07 R39.2 57.75,44.07 57.11,44.72 53.89,44.72 53.88,44.7 v53.34,44.7 | R3.1 26.16,44.7 v26.16,44.58 | v50.29,44.58 49.88,44.16 U5.26
D25/PB03_RX_LED  (via drill 0.2 pad 0.41)
  Top 0.152: v42.8,38.35 44.2,36.96 47.75,36.96 48.13,36.58 48.13,34.54 48.51,34.16 53.21,34.16 55.5,36.45 55.5,41.53 v54.61,42.42
  Bottom 0.152: U5.48 42.91,38.46 v42.8,38.35 | v54.61,42.42 54.36,42.67 R35.1
D26/PA27_TX_LED  (via drill 0.2 pad 0.41)
  Top 0.152: v47.62,36.32 47.62,34.16 48.01,33.78 53.72,33.78 55.88,35.94 55.88,43.31 53.98,45.21 v50.55,45.21
  Bottom 0.152: U5.39 47.6,38.07 47.62,38.04 v47.62,36.32 | v50.55,45.21 50.55,46.23 50.29,46.48 49.66,46.48 R34.1
D32/SDA/PA22  (via drill 0.2, 0.2 pad 0.41)
  Top 0.152: 50.8,41.59 v50.86,41.66 50.86,40.07 v51.05,39.88 | v61.34,34.29 v61.34,29.85
  Bottom 0.152: I2C.2 61.34,28.69 | 61.34,28.69 I2C1.2 I2C2.2 | U5.31 v50.86,41.66 51.12,41.91 51.12,43.88 R38.1 | v51.05,39.88 52.77,39.88 55.14,37.51 55.14,35.41 56.26,34.29 v61.34,34.29 | v61.34,29.85 61.34,28.69
D33/SCL/PA23  (via drill 0.2 pad 0.41)
  Top 0.152: v52.58,39.37 51.56,40.39 v51.56,41.4
  Bottom 0.152: I2C.1 I2C1.1 54.48,30.69 | U5.32 51.32,41.16 v51.56,41.4 51.94,41.78 R37.1 | 54.48,30.69 I2C2.1 | 54.48,30.69 54.48,37.47 v52.58,39.37
D38/ATN/GROVE_POWER_EN/DGI_GPIO0  (via drill 0.2 pad 0.41, 0.25 pad 0.51)
  Top 0.152: v49.53,45.97 55.88,45.97 57.02,44.83 57.02,33.66 52.7,29.34 52.7,23.75 52.07,23.11 48.13,23.11 46.86,21.84 v46.86,20.19
  Bottom 0.152: 42.86,18.61 Q3.1 46.61,18.8 R41.1 v46.86,20.19 | U5.22 47.6,45.82 47.82,46.04 49.47,46.04 v49.53,45.97
D42/AREFA_PA03
  Bottom 0.127: C18.2 41.51,40.66
  Bottom 0.152: U5.4 41.51,40.66
GND  (via drill 0.2, 0.2 pad 0.41, 0.35)
  Top 0.152: v38.86,30.48 38.86,35.83 v39.74,36.7 | v38.23,16.51 v38.23,11.05 | v53.59,33.17 53.89,33.17 56.39,35.67 v56.39,35.69 | v46.23,3.43 v43.18,3.43 | v8.89,44.58 11.3,46.99 | 11.3,46.99 v25.65,46.99 | 11.3,46.99 9.27,46.99 v9.02,47.24
  Bottom 0.152: 64.64,18.72 I2C.4 I2C1.4 56.94,25.4 51.13,25.4 I2C2.4 | Q3.2 42.93,17.53 | Q3.2 40.77,17.53 39.75,16.51 v38.23,16.51 37.85,16.89 C31.1 37.66,20.76 37.66,23.54 U8.1 | U6.1 33.08,43.37 32.38,44.07 30.86,44.07 29.4,45.53 C28.1 27.88,46.99 v25.65,46.99 | 35.82,43.37 U6.1 | 44.83,30.48 47.75,30.48 50.44,33.17 v53.59,33.17 | J4.5 64.26,40.99 64.06,40.79 64.06,39.52 64.43,39.15 | 64.43,39.15 J4.S6 67.01,39.15 J4.S5 67.18,41.22 J4.S4 J4.S3 67.18,43.87 J4.S2 67.01,45.95 J4.S1 63.09,45.95 61.09,43.94 | 64.43,39.15 63.3,38.03 D3.2 60.01,35.69 v56.39,35.69 | Q1.2 56.85,41.11 58.86,41.11 59.23,41.47 | 59.23,41.47 59.31,41.55 59.31,42.55 60.71,43.94 61.09,43.94 | 59.23,41.47 59.39,41.47 59.57,41.29 61.16,41.29 61.59,41.73 D4.2 | U5.PAD 45.85,44.32 45.59,44.58 U5.18 45.74,45.51 45.74,45.77 45.85,45.87 45.85,47.63 C25.1 44.2,49.78 38.73,49.78 38.35,49.4 C27.1 | U5.PAD 45.85,41.28 | 45.85,41.28 45.85,39.5 46.1,39.24 U5.42 | U5.PAD 48.1,39.66 U5.35 50.64,39.66 51.05,39.24 51.05,37.85 C24.2 | v38.23,11.05 40.07,9.21 42.25,9.21 43.06,10.02 | 43.06,10.02 U7.1 | 61.09,43.94 R36.1 59.56,45.59 R39.1 | 61.09,43.82 61.09,43.94 | 50.48,1.08 49.15,2.41 RST.1 49.15,3.3 49.02,3.43 v46.23,3.43 | 50.48,1.08 RST.S1 | v43.18,3.43 43.18,1.27 RST.S2 | C27.1 C20.2 40.32,47.24 39.5,47.24 39.24,46.99 39.24,46.36 38.99,46.1 C21.2 38.99,41.91 C18.1 C17.1 38.86,39.37 C16.1 39.74,37.2 v39.74,36.7 | 38.73,24.75 U8.1 | C27.1 38.29,48.77 | U6.1 35.26,41.04 C26.1 34.48,40.58 33.53,39.62 33.53,34.42 C1.2 32.38,33.15 | 42.38,41.15 U5.5 45.73,41.16 45.85,41.28 | 44.83,30.48 44.83,34.93 C19.2 46.41,35.05 46.95,34.52 49.25,34.52 C23.2
  Bottom 0.152: 44.83,30.48 C22.2 | v38.86,30.48 38.86,27.69 C32.1 38.8,26.36 U8.1 | v43.18,3.43 38.61,3.43 SOL.4 SOL.3 29.97,1.78 32.38,4.19 SOL.- | 44.83,30.48 v38.86,30.48 | v38.86,30.48 38.1,29.72 36.2,29.72 32.77,33.15 32.38,33.15 | ANT1.GND1 8.66,44.35 v8.89,44.58 | v9.02,47.24 5.1,47.24 ANT1.GND2 | BAT.3 BAT.4 61.98,7.49 65.28,10.8 65.28,18.09 64.64,18.72 | BAT.3 51.05,1.65 50.48,1.08 | BAT.3 55.12,6.35 BAT.- 57.53,9.78 | C30.1 43.2,10.29 U7.1 | U1.8 U1.11 | U1.8 51.05,15.88 R7.2 50.29,12.19 C29.1 43.46,10.03 U7.1 | C2.1 C3.2 63.96,18.03 64.64,18.72 | v43.18,3.43 43.18,9.91 43.06,10.02 | U1.8 U1.9 | Q3.2 R41.2 | U2.2 29.76,35.77 32.38,33.15
  pour Bottom (isolate 0.152, rank 6, no thermals): 8.26,47.63 2.54,47.63 2.54,43.94 8.26,43.94
GROVE_3V3
  Bottom 0.152: U8.2 40.7,26.73 C32.2
  Bottom 0.61: I2C.3 I2C1.3 I2C2.3 48.9,25.16 42.91,25.16 C32.2
LIPO_BAT
  Bottom 0.152: C2.2 56.17,15.24 U1.4 U1.3
LORA_3V3  (via drill 0.2 pad 0.2)
  Top 0.152: v31.5,46.48 27.56,46.48 26.06,44.98 25.99,44.98 25.76,44.75 25.76,44.7 19.56,44.7 v18.8,43.94 | v18.8,40.13 v24.13,34.8
  Bottom 0.152: C27.2 37.63,46.46 36.45,46.46 U6.2 31.12,45.27 C28.2 31.5,46.16 v31.5,46.48 | C1.1 30.65,33.23 U2.3 25.7,33.23 v24.13,34.8 | v18.8,43.94 v18.8,40.13
N$1
  Bottom 0.152: R33.1 56.64,43.31 Q1.3
N$2
  Bottom 0.152: TX.- R34.2
N$3
  Bottom 0.152: C13.2 26.29,45.72 27.81,44.2 27.81,38.73 U2.1
N$4
  Bottom 0.152: RX.- 54.78,45.59 R35.2
N$5
  Bottom 0.152: L.- 56.98,45.59 R33.2
N$6
  Bottom 0.152: U2.14 13.16,33.23 21.12,41.19 R1.2
N$7
  Bottom 0.152: J4.3 63.12,42.55 62.87,42.29 62.87,39.12 62.68,38.93 D3.1 62.29,38.86 R43.1 60.89,38.86
N$10
  Bottom 0.152: J4.2 63.26,43.2 62.56,42.49 62.56,41.22 62.16,40.83 D4.1 61.54,40.39 R42.1
N$11
  Bottom 0.152: ANT1.D C13.1
  Bottom 0.406: ANT1.D 3.56,44.89 3.52,44.86 3.52,43.84 3.56,43.81 ANT3.1
N$12
  Bottom 0.152: PWR.- | PWR.- R36.2
N$13
  Bottom 0.152: U2.15 12.53,35.77 16.98,40.22 R2.2
N$14
  Bottom 0.152: U2.13 14.3,30.69 25.27,41.66 R3.2
N$15
  Bottom 0.152: U2.16 9.94,39.41 R4.2
N$16
  Bottom 0.152: U2.4 30.69,30.69 R5.2
N$17
  Bottom 0.152: R6.2 30.69,28.15 U2.5
N$18
  Bottom 0.152: U1.10 50.53,16.88 R7.1
N$45
  Bottom 0.152: Q2.3 40.77,20.57 C31.2 39.37,22.18 U8.3
N$53
  Bottom 0.152: 42.86,21.15 Q2.1 | Q3.3 41.02,18.16 41.78,18.92 41.78,20.45 Q2.1 | R40.2 43.43,22.1 Q2.1
N$57
  pour Top (isolate 0.152, no thermals): 2.54,41.4 3.81,41.4 arc90 4.45,42.04 4.45,42.93 arc90 3.81,43.56 2.54,43.56
  pour Bottom (isolate 0.152, no thermals): 2.54,41.4 3.81,41.4 arc90 4.45,42.04 4.45,42.93 arc90 3.81,43.56 2.54,43.56
PA00_XIN32  (via drill 0.2, 0.2 pad 0.41)
  Top 0.152: v41.53,39.12 41.4,39.12 v38.73,36.45
  Bottom 0.152: U5.1 42.35,39.12 v41.53,39.12 | C16.2 38.73,37.72 v38.73,36.45 36.7,34.42 X1.2
PA01_XOUT32  (via drill 0.2 pad 0.41)
  Top 0.152: v40.39,38.86 37.21,38.86 v37.08,38.74
  Bottom 0.152: U5.2 40.6,39.66 C17.2 v40.39,38.86 | v37.08,38.74 35.81,37.47 X1.1
TARGET_RESET  (via drill 0.2 pad 0.41)
  Top 0.152: v47.12,34.93 47.12,29.59 v46.99,29.46
  Bottom 0.152: U5.40 47.1,34.95 v47.12,34.93 48.39,36.2 50.93,36.2 C23.1 51.94,35.69 R32.1 | v46.99,29.46 46.99,29.08 45.7,27.79 44.07,27.79 43.9,27.62 D2.+
TARGET_USB-N
  Bottom 0.152: U5.33 50.57,40.66 50.67,40.77 53.4,40.77 54.67,39.5 56.9,39.5 57.78,40.39 R42.2
TARGET_USB-P
  Bottom 0.152: U5.34 50.51,40.16 50.8,40.45 53.28,40.45 54.61,39.12 57.02,39.12 57.28,38.86 R43.2
USB5V
  Bottom 0.356: J4.1 63.15,43.85 63.12,43.82
  Bottom 0.61: 63.12,43.82 62.61,43.82 60.96,42.16 F1.1
VDDCORE  (via drill 0.2 pad 0.41)
  Top 0.152: v46.1,29.97 46.1,36.07 v46.23,36.2
  Bottom 0.152: C22.1 43.31,29.46 44.2,28.58 45.47,28.58 46.1,29.21 v46.1,29.97 | v46.23,36.2 45.6,36.83 U5.43
VIN  (via drill 0.25 pad 0.51)
  Top 0.61: v45.09,14.48 44.96,14.61 44.96,19.43 v44.83,19.43 | v36.01,39.5 36.01,24.45 v36.07,24.38 | v57.66,41.91 57.66,33.4 53.59,29.34 v53.59,24.26
  Bottom 0.152: C3.1 57.4,16.38 U1.2 U1.1 | SOL.+ 34.42,12.95 36.07,14.61 | v44.83,19.43 44.83,20.45 R40.1 | R40.1 43.18,20.57 Q2.2 | R40.1 45.85,20.57 46.69,21.41 53.59,21.41
  Bottom 0.406: 53.59,23.75 53.59,21.41 53.59,20.45 56.03,18.01 U1.1
  Bottom 0.61: v36.07,24.38 36.07,14.61 44.96,14.61 v45.09,14.48 48.01,11.56 C29.2 45.76,11.56 U7.3 | U6.3 37.38,41.83 36.32,40.77 C26.2 36.32,39.82 v36.01,39.5 | F1.2 57.91,42.16 v57.66,41.91 | v53.59,24.26 53.59,23.75

### Text on the board
bNames: TX | RX | L | PWR | LoRa | SCL | SCL | SCL | SDA | SDA | SDA | I2C | I2C | I2C | 3V3 | 3V3 | 3V3 | GND | GND | GND | Aircitizen LoRaWAN | BAT | - | + | RST
bValues: 8p female | 10p female | 2x3 male | 6p female | 8p female